# Altium project W55RP20-EVB-Pico_V100.PrjPcb
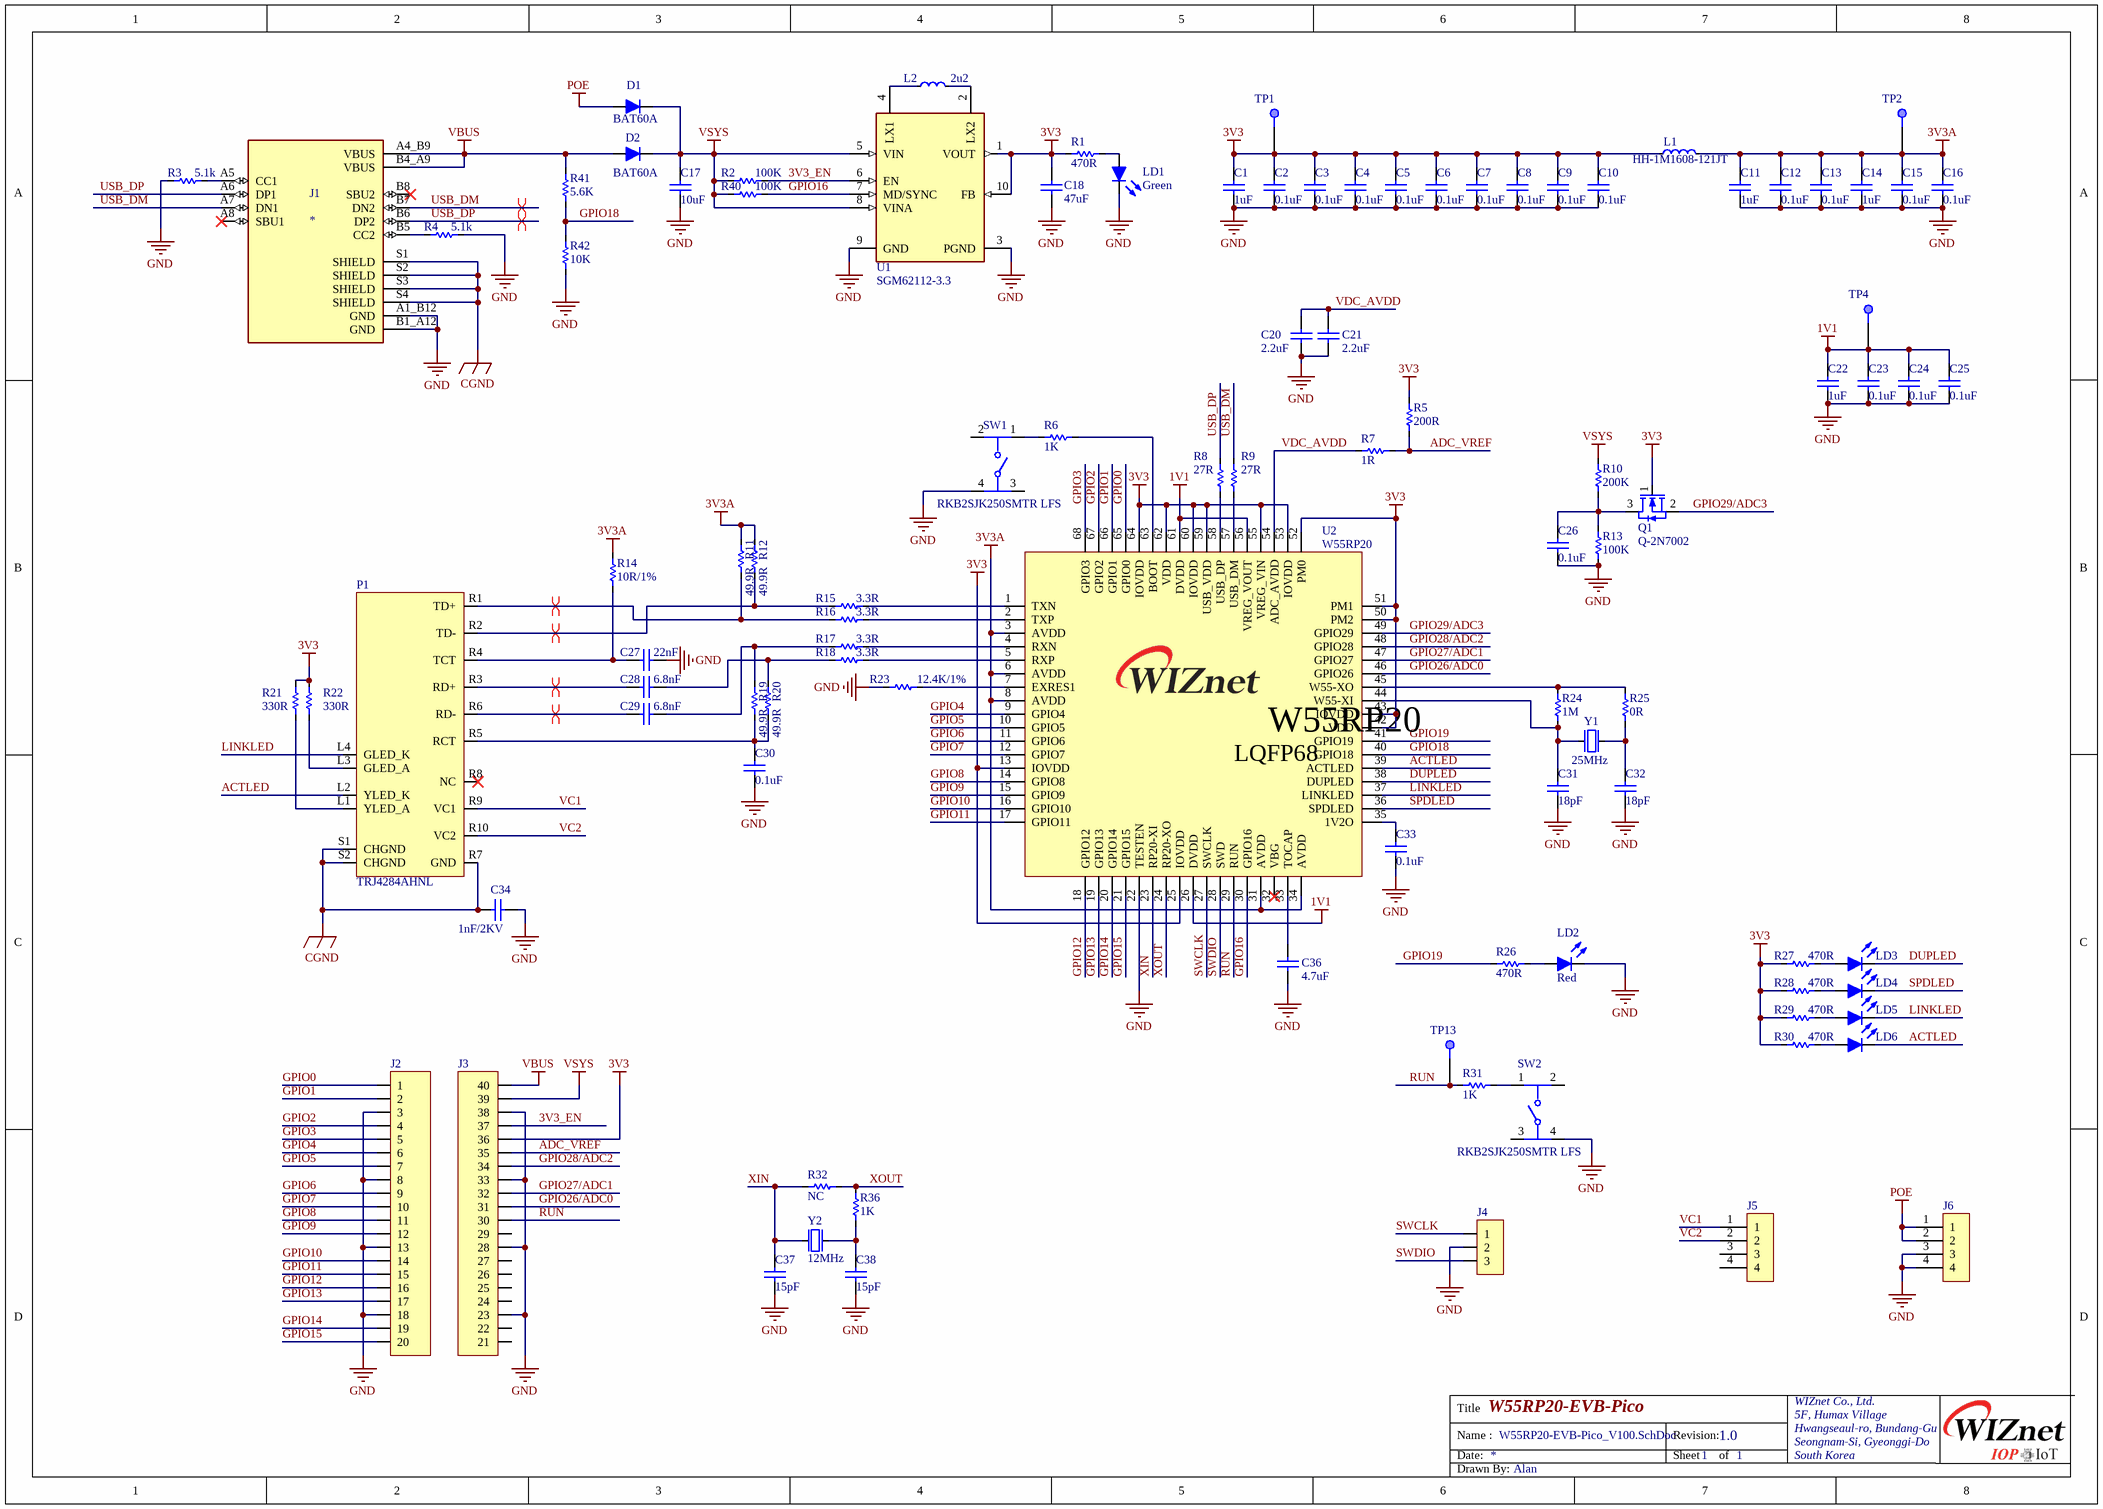
[diagram p0: W55RP20-EVB-Pico_V100.SchDoc]
1 sheet, 100 parts. Net scope: global (net labels, ports and power ports of the same name join across sheets).
Board file: W55RP20-EVB-Pico_V100.PcbDoc

## Sheet W55RP20-EVB-Pico_V100.SchDoc: W55RP20-EVB-Pico
size A3; DrawnBy: Alan; Organization: WIZnet Co., Ltd.; Address1: 5F, Humax Village; Address2: Hwangseaul-ro, Bundang-Gu; Address3: Seongnam-Si, Gyeonggi-Do; Address4: South Korea; Revision: 1.0; SheetNumber: 1; SheetTotal: 1

### Parts
C1  1uF  [CAP-0402]
C2  0.1uF  [CAP-0402]
C3  0.1uF  [CAP-0402]
C4  0.1uF  [CAP-0402]
C5  0.1uF  [CAP-0402]
C6  0.1uF  [CAP-0402]
C7  0.1uF  [CAP-0402]
C8  0.1uF  [CAP-0402]
C9  0.1uF  [CAP-0402]
C10  0.1uF  [CAP-0402]
C11  1uF  [CAP-0402]
C12  0.1uF  [CAP-0402]
C13  0.1uF  [CAP-0402]
C14  1uF  [CAP-0402]
C15  0.1uF  [CAP-0402]
C16  0.1uF  [CAP-0402]
C17  10uF  [CAP-0402]
C18  47uF  [CAP-0805]
C20  2.2uF  [CAP-0402]
C21  2.2uF  [CAP-0402]
C22  1uF  [CAP-0402]
C23  0.1uF  [CAP-0402]
C24  0.1uF  [CAP-0402]
C25  0.1uF  [CAP-0402]
C26  0.1uF  [CAP-0402]
C27  22nF  [CAP-0402]
C28  6.8nF  [CAP-0402]
C29  6.8nF  [CAP-0402]
C30  0.1uF  [CAP-0402]
C31  18pF  [CAP-0402]
C32  18pF  [CAP-0402]
C33  0.1uF  [CAP-0402]
C34  1nF/2KV  [CAP-1808]
C36  4.7uF  [CAP-0603]
C37  15pF  [CAP-0402]
C38  15pF  [CAP-0402]
D1  BAT60A  [SOD-323(1-C,2-A)]
D2  BAT60A  [SOD-323(1-C,2-A)]
J1  *  [USB-TYPE-C-31-M-12]
J2  2.54mm 1x20 Pin Header DIP  [IDC-1X20]  (value not drawn)
J3  2.54mm 1x20 Pin Header DIP  [IDC-1X20]  (value not drawn)
J4  2.54mm 1x3 Pin Header DIP  [IDC-1X3]  (value not drawn)
J5  Header Socket 1x4_2.54mm  [IDC-1X4(SOCKET)]  (value not drawn)
J6  Header Socket 1x4_2.54mm  [IDC-1X4(SOCKET)]  (value not drawn)
L1  HH-1M1608-121JT  [IND-0603]
L2  2u2  [L0805(2012)]
LD1  Green  [LED-0603-RED]
LD2  Red  [LED-0603-RED]
LD3  Red  [LED-0603-RED]  (value not drawn)
LD4  Red  [LED-0603-RED]  (value not drawn)
LD5  Red  [LED-0603-RED]  (value not drawn)
LD6  Red  [LED-0603-RED]  (value not drawn)
P1  TRJ4284AHNL  [RB1-ZZ-0049]
Q1  Q-2N7002  [SOT23-3L]
R1  470R  [RES-0402]
R2  100K  [RES-0402]
R3  5.1k  [RES-0402]
R4  5.1k  [RES-0402]
R5  200R  [RES-0402]
R6  1K  [RES-0402]
R7  1R  [RES-0402]
R8  27R  [RES-0402]
R9  27R  [RES-0402]
R10  200K  [RES-0402]
R11  49.9R  [RES-0402]
R12  49.9R  [RES-0402]
R13  100K  [RES-0402]
R14  10R/1%  [RES-0402]
R15  3.3R  [RES-0402]
R16  3.3R  [RES-0402]
R17  3.3R  [RES-0402]
R18  3.3R  [RES-0402]
R19  49.9R  [RES-0402]
R20  49.9R  [RES-0402]
R21  330R  [RES-0402]
R22  330R  [RES-0402]
R23  12.4K/1%  [RES-0402]
R24  1M  [RES-0402]
R25  0R  [RES-0402]
R26  470R  [RES-0402]
R27  470R  [RES-0402]
R28  470R  [RES-0402]
R29  470R  [RES-0402]
R30  470R  [RES-0402]
R31  1K  [RES-0402]
R32  NC  [RES-0402]
R36  1K  [RES-0402]
R40  100K  [RES-0402]
R41  5.6K  [RES-0402]
R42  10K  [RES-0402]
SW1  RKB2SJK250SMTR LFS  [SW-RKB2]
SW2  RKB2SJK250SMTR LFS  [SW-RKB2]
TP1  TP  [TPS]  (value not drawn)
TP2  TP  [TPS]  (value not drawn)
TP4  TP  [TPS]  (value not drawn)
TP13  TP  [TPS]  (value not drawn)
U1  SGM62112-3.3  [TDFN10(0.5/3X3)]
U2  W55RP20  [QFN68(0.4/8X8)]
Y1  25MHz  [OSC-82J0626]
Y2  12MHz  [OSC-TZ1067B]

### Nets
1V1: C22.2 C23.2 C24.2 C25.2 TP4.1 U2.26(DVDD) U2.56(VREG_VOUT) U2.61(DVDD)
3V3: C1.2 C2.2 C3.2 C4.2 C5.2 C6.2 C7.2 C8.2 C9.2 C10.2 C18.2 J3.16(36) L1.1 Q1.1(G) R1.1 R5.1 R21.2 R22.2 R27.1 R28.1 R29.1 R30.1 TP1.1 U1.1(VOUT) U1.10(FB) U2.13(IOVDD) U2.25(IOVDD) U2.42(VDD) U2.43(IOVDD) U2.50(PM2) U2.51(PM1) U2.52(PM0) U2.53(IOVDD) U2.55(VREG_VIN) U2.59(USB_VDD) U2.60(IOVDD) U2.62(VDD) U2.64(IOVDD)
3V3A: C11.2 C12.2 C13.2 C14.2 C15.2 C16.2 L1.2 R11.2 R12.2 R14.1 TP2.1 U2.3(AVDD) U2.6(AVDD) U2.8(AVDD) U2.31(AVDD) U2.34(AVDD)
CGND: C34.1 J1.S1(SHIELD) J1.S2(SHIELD) J1.S3(SHIELD) J1.S4(SHIELD) P1.R7(GND) P1.S1(CHGND) P1.S2(CHGND)
GND: C1.1 C2.1 C3.1 C4.1 C5.1 C6.1 C7.1 C8.1 C9.1 C10.1 C11.1 C12.1 C13.1 C14.1 C15.1 C16.1 C17.1 C18.1 C20.1 C21.1 C22.1 C23.1 C24.1 C25.1 C26.2 C27.1 C30.1 C31.1 C32.1 C33.1 C34.2 C36.1 C37.2 C38.2 J1.A1_B12(GND) J1.B1_A12(GND) J2.3 J2.8 J2.13 J2.18 J3.3(23) J3.8(28) J3.13(33) J3.18(38) J4.2 J6.3 J6.4 LD1.2(K) LD2.2(K) R3.2 R4.1 R13.1 R23.1 R42.1 SW1.4 SW2.4 U1.3(PGND) U1.9(GND) U2.22(TESTEN) Y1.2(GND) Y1.4(GND) Y2.2 Y2.4
POE: D1.2(A) J6.1 J6.2
VBUS: D2.2(A) J1.A4_B9(VBUS) J1.B4_A9(VBUS) J3.20(40) R41.2
VSYS: C17.2 D1.1(K) D2.1(K) J3.19(39) R2.1 R10.2 R40.1 U1.5(VIN) U1.8(VINA)
3V3_EN: J3.17(37) R2.2 U1.6(EN)
ACTLED: LD6.2(K) P1.L2(YLED_K) U2.39(ACTLED)
ADC_VREF: J3.15(35) R5.2 R7.2
DUPLED: LD3.2(K) U2.38(DUPLED)
GPIO0: J2.1 U2.65(GPIO0)
GPIO1: J2.2 U2.66(GPIO1)
GPIO2: J2.4 U2.67(GPIO2)
GPIO3: J2.5 U2.68(GPIO3)
GPIO4: J2.6 U2.9(GPIO4)
GPIO5: J2.7 U2.10(GPIO5)
GPIO6: J2.9 U2.11(GPIO6)
GPIO7: J2.10 U2.12(GPIO7)
GPIO8: J2.11 U2.14(GPIO8)
GPIO9: J2.12 U2.15(GPIO9)
GPIO10: J2.14 U2.16(GPIO10)
GPIO11: J2.15 U2.17(GPIO11)
GPIO12: J2.16 U2.18(GPIO12)
GPIO13: J2.17 U2.19(GPIO13)
GPIO14: J2.19 U2.20(GPIO14)
GPIO15: J2.20 U2.21(GPIO15)
GPIO16: R40.2 U1.7(MD/SYNC) U2.30(GPIO16)
GPIO18: R41.1 R42.2 U2.40(GPIO18)
GPIO19: R26.1 U2.41(GPIO19)
GPIO26/ADC0: J3.11(31) U2.46(GPIO26)
GPIO27/ADC1: J3.12(32) U2.47(GPIO27)
GPIO28/ADC2: J3.14(34) U2.48(GPIO28)
GPIO29/ADC3: Q1.2(S) U2.49(GPIO29)
LINKLED: LD4.2(K) P1.L4(GLED_K) U2.37(LINKLED)
RUN: J3.10(30) R31.2 TP13.1 U2.29(RUN)
SPDLED: LD5.2(K) U2.36(SPDLED)
SWCLK: J4.1 U2.27(SWCLK)
SWDIO: J4.3 U2.28(SWD)
USB_DM: J1.A7(DN1) J1.B7(DN2) R9.1
USB_DP: J1.A6(DP1) J1.B6(DP2) R8.1
VC1: J5.1 P1.R9(VC1)
VC2: J5.2 P1.R10(VC2)
VDC_AVDD: C20.2 C21.2 R7.1 U2.54(ADC_AVDD)
XIN: C37.1 R32.2 U2.23(RP20-XI) Y2.1(inp)
XOUT: R32.1 R36.2 U2.24(RP20-XO)
NetC26_1: C26.1 Q1.3(D) R10.1 R13.2
NetC27_2: C27.2 P1.R4(TCT) R14.2
NetC28_1: C28.1 R18.1 R20.2
NetC28_2: C28.2 P1.R3(RD+)
NetC29_1: C29.1 R17.1 R19.2
NetC29_2: C29.2 P1.R6(RD-)
NetC30_2: C30.2 P1.R5(RCT) R19.1 R20.1
NetC31_2: C31.2 R24.1 U2.44(W55-XI) Y1.1(inp)
NetC32_2: C32.2 R25.1 Y1.3(out)
NetC33_2: C33.2 U2.35(1V2O)
NetC36_2: C36.2 U2.33(TOCAP)
NetC38_1: C38.1 R36.1 Y2.3(out)
NetJ1_A5: J1.A5(CC1) R3.1
NetJ1_B5: J1.B5(CC2) R4.2
NetL2_1: L2.1 U1.4(LX1)
NetL2_2: L2.2 U1.2(LX2)
NetLD1_1: LD1.1(A) R1.2
NetLD2_1: LD2.1(A) R26.2
NetLD3_1: LD3.1(A) R27.2
NetLD4_1: LD4.1(A) R29.2
NetLD5_1: LD5.1(A) R28.2
NetLD6_1: LD6.1(A) R30.2
NetP1_L1: P1.L1(YLED_A) R21.1
NetP1_L3: P1.L3(GLED_A) R22.1
NetP1_R1: P1.R1(TD+) R11.1 R16.1
NetP1_R2: P1.R2(TD-) R12.1 R15.1
NetR6_1: R6.1 U2.63(BOOT)
NetR6_2: R6.2 SW1.1
NetR8_2: R8.2 U2.58(USB_DP)
NetR9_2: R9.2 U2.57(USB_DM)
NetR15_2: R15.2 U2.1(TXN)
NetR16_2: R16.2 U2.2(TXP)
NetR17_2: R17.2 U2.4(RXN)
NetR18_2: R18.2 U2.5(RXP)
NetR23_2: R23.2 U2.7(EXRES1)
NetR24_2: R24.2 R25.2 U2.45(W55-XO)
NetR31_1: R31.1 SW2.1

Not connected (* = marked no-connect by the designer): J1 A8(SBU1)* B8(SBU2)*; J3 1(21) 2(22) 4(24) 5(25) 6(26) 7(27) 9(29); J5 3 4; P1 R8(NC)*; SW1 2 3; SW2 2 3; U2 32(VBG)*

### Layout directives
differential pair: NetC28_2, NetC29_2, NetP1_R1, NetP1_R2, USB_DM, USB_DP

### Notes on the sheet
- Title
- Date:
- Name :
- Revision:
- Sheet
- of
- Drawn By:
- (in symbol W55RP20_2) LQFP68

### Library data of the parts
C1-C17 C20-C33 C37 C38 = CAP-0402: Ceramic CAP 0402(1005)
C18 = CAP-0805: MLCC-0805(2012)
C34 = CAP-1808: MLCC-1808(4520)
C36 = CAP-0805: Ceramic CAP 0805(2012)
D1 D2 = DIODE-BAT60A: Silicon Schottky Diode
J1 = TYPE-C-31-M-12: USB Connectors 24 Receptacle 1 8.94*7.3mm RoHS; MF: HRO Electronics Co., Ltd.; Price: None; Value: *; SnapEDA_Link: https://www.snapeda.com/parts/TYPE-C-31-M-12/HRO+Electronics+Co.%252C+Ltd./view-part/?ref=snap; Package: Package; Availability: Not in stock; Check_prices: https://www.snapeda.com/parts/TYPE-C-31-M-12/HRO+Electronics+Co.%252C+Ltd./view-part/?ref=eda; MP: TYPE-C-31-M-12
J5 J6 = Header Socket 1x4_2.54mm: Connector; Manufacturer_Name: Harwin; Manufacturer_Part_Number: M20-7820442; Datasheet Link: https://cdn.harwin.com/pdfs/M20-782.pdf; Height: 8.65mm; Mouser Part Number: 855-M20-7820442; Mouser Price/Stock: https://www.mouser.co.uk/ProductDetail/Harwin/M20-7820442?qs=vF78I%252BjhbY9ZgDLCXkGx4w%3D%3D
L1 = IND-0603: Inductor 0603(1608)
L2 = IND-0805: Inductor 0805(2012)
LD1-LD6 = LED-0603
P1 = RB1-ZZ-0049: PoE RJ45
Q1 = Q-2N7002: N-Channel 60-V (D-S) MOSFET
R1-R32 R36 R40-R42 = RES-0402
SW1 SW2 = CMP-10040-000001-2: RKB2 DC 12V 50 mA max. 200mΩ max. 100MΩ 250 gf, -40˚C to 90˚C; Throw Configuration: SPST; Operating Force: 160gf; Actuator Type: Standard; Voltage Rating (DC): 16V; Switch Travel: 0.15mm; Switch Function: Off-Mom; Max Current Rating: 50mA; Mechanical Life: 150000Cycles; Illumination Type: Non-Illuminated; Package Quantity: 2900; Depth: 4.6mm; Mount: Surface Mount; Packaging: Tape and Reel; Length: 3.2mm; RoHS Compliant: Yes; Case/Package: SMD/SMT; Min Operating Temperature: -40°C; Termination: J-Bend; Lead Free: Lead Free; Contact Plating: Silver; Orientation: Straight; Max Operating Temperature: 85°C; Current Rating: 50mA; Color: Black
TP1 TP2 TP4 TP13 = TP: Test_point; Manufacturer: Wurth Elektronik; Part Number: 61300211121; Rated Current: 3A; Gender: Male; Withstanding Voltage: 500VAC; Working Voltage: 250VAC; Pitch: 2.54mm; Contact Resistance: 20mOhm; Row Number: Single; Pin Number: 2; Mounting Technology: THT; Orientation: Vertical; Operating Temperature: -40to105degC; Packaging: Bag; Publisher: WurthElektronik; Datasheet URL: https://katalog.we-online.de/em/datasheet/6130xx11121.pdf; Manufacturer URL: http://www.we-online.de; Package Reference: 61300211121
U1 = SGM62112-3.3: Buck-Boost Switching Regulator IC Positive Adjustable 1.8V 1 Output 800mA 10-WFDFN Exposed Pad; MF: Richtek USA; MP: RT6150AGQW; Digi-Key_Part_Number: 1028-1259-1-ND; Digi-Key_Purchase_URL: https://www.digikey.com/product-detail/en/richtek-usa-inc/RT6150AGQW/1028-1259-1-ND/4733181?utm_source=snapeda&utm_medium=aggregator&utm_campaign=symbol; SnapEDA_Link: https://www.snapeda.com/parts/RT6150AGQW/Richtek%20USA%20Inc./view-part/1219544/?ref=snap; Package: WFDFN-10 Richtek; Value: *
U2 = W55RP20_2: WIZnet Hardwired TCP/IP Chip
Y1 = OSC-82J0626-25MHz: X-tal 25MHz,3.2x2.5 SMD, CL=18pF
Y2 = OSC-TZ1067B-12MHz: X-tal 12MHz,3.2x2.5 SMD, CL=20pF